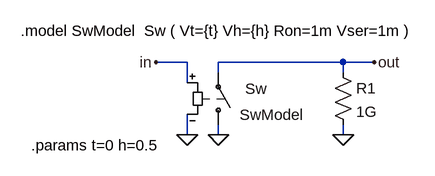
[diagram p0: schematic Hyster.asc]
Hyster.asc, the LTspice schematic file:
Version 4
SHEET 1 1288 680
WIRE 288 96 240 96
WIRE 528 96 336 96
WIRE 576 96 528 96
WIRE 336 112 336 96
WIRE 528 112 528 96
WIRE 288 128 288 96
WIRE 288 208 288 176
WIRE 336 208 336 192
WIRE 528 208 528 192
FLAG 576 96 out
FLAG 240 96 in
FLAG 288 208 0
FLAG 528 208 0
FLAG 336 208 0
SYMBOL sw 336 208 M180
WINDOW 0 41 71 Left 0
WINDOW 3 33 31 Left 0
SYMATTR InstName Sw
SYMATTR Value SwModel
SYMBOL res 512 96 R0
SYMATTR InstName R1
SYMATTR Value 1G
TEXT 32 48 Left 0 !.model SwModel  Sw ( Vt={t} Vh={h} Ron=1m Vser=1m )
TEXT 48 224 Left 0 !.params t=0 h=0.5

The netlist it stands for:
* Hyster.asc
Sw 0 out in 0 SwModel
R1 out 0 1G
.model SwModel  Sw ( Vt={t} Vh={h} Ron=1m Vser=1m )
.params t=0 h=0.5
.backanno
.end